# EAGLE design LowKey-BASIC-TOP (EAGLE 9.6.2)
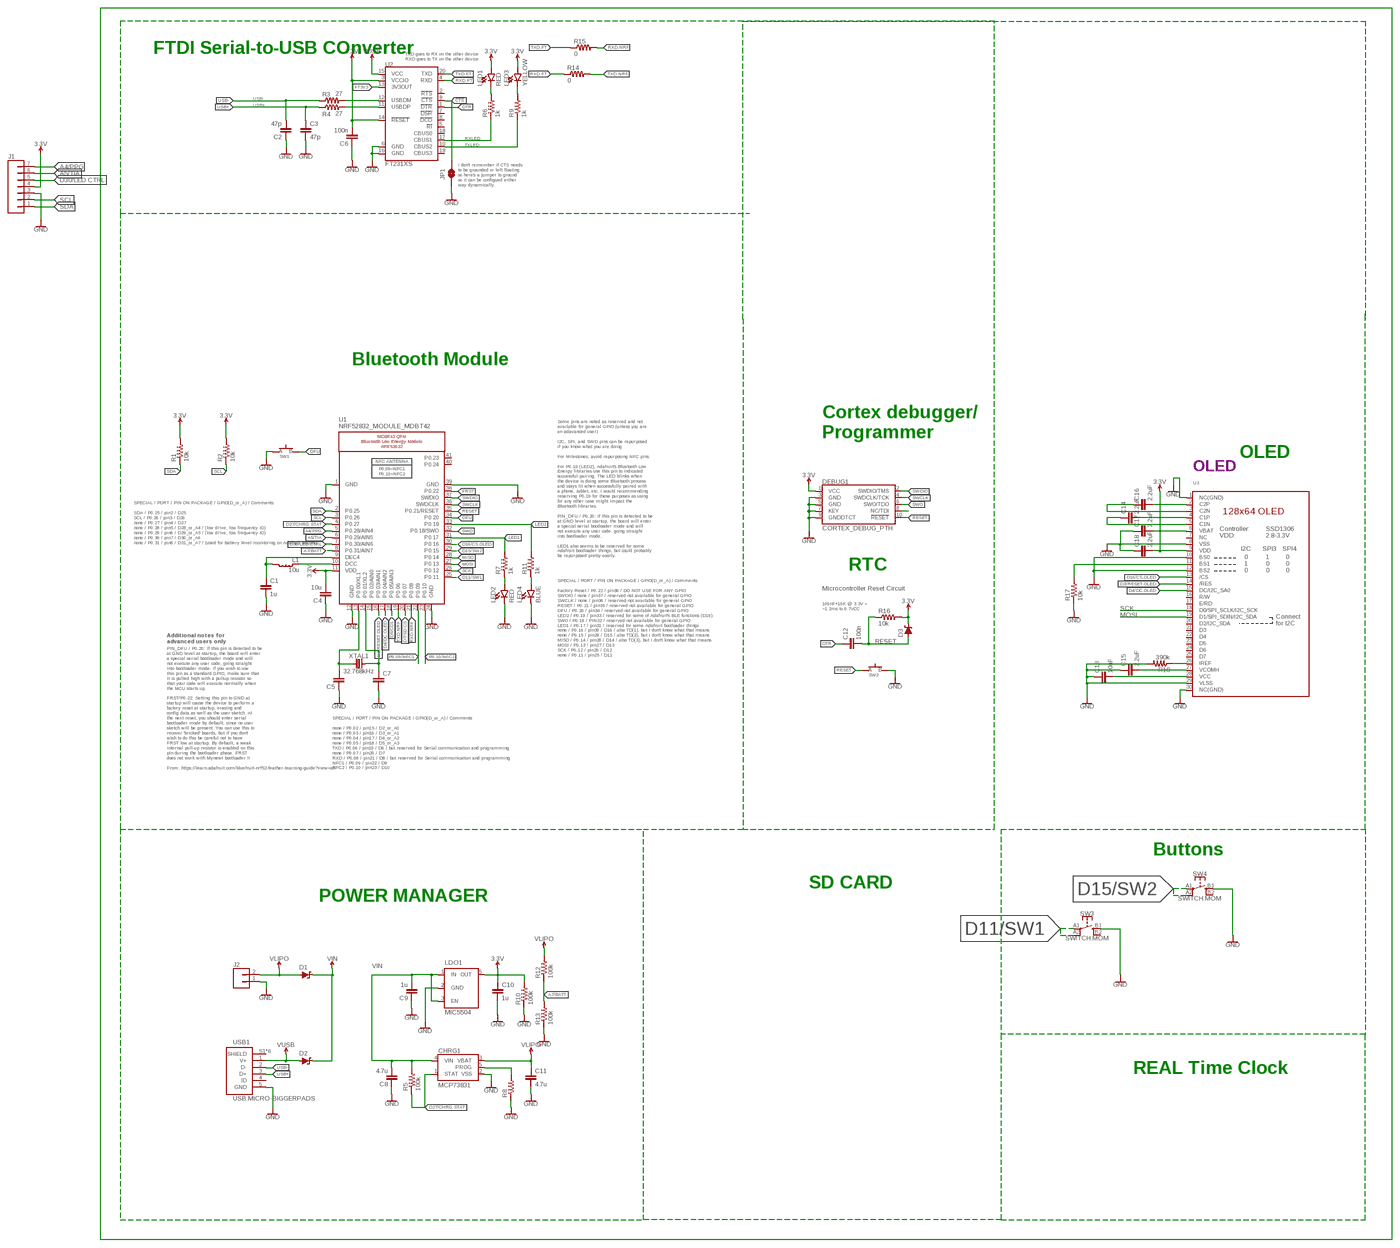
[diagram p0: schematic, sheet 1, overview]
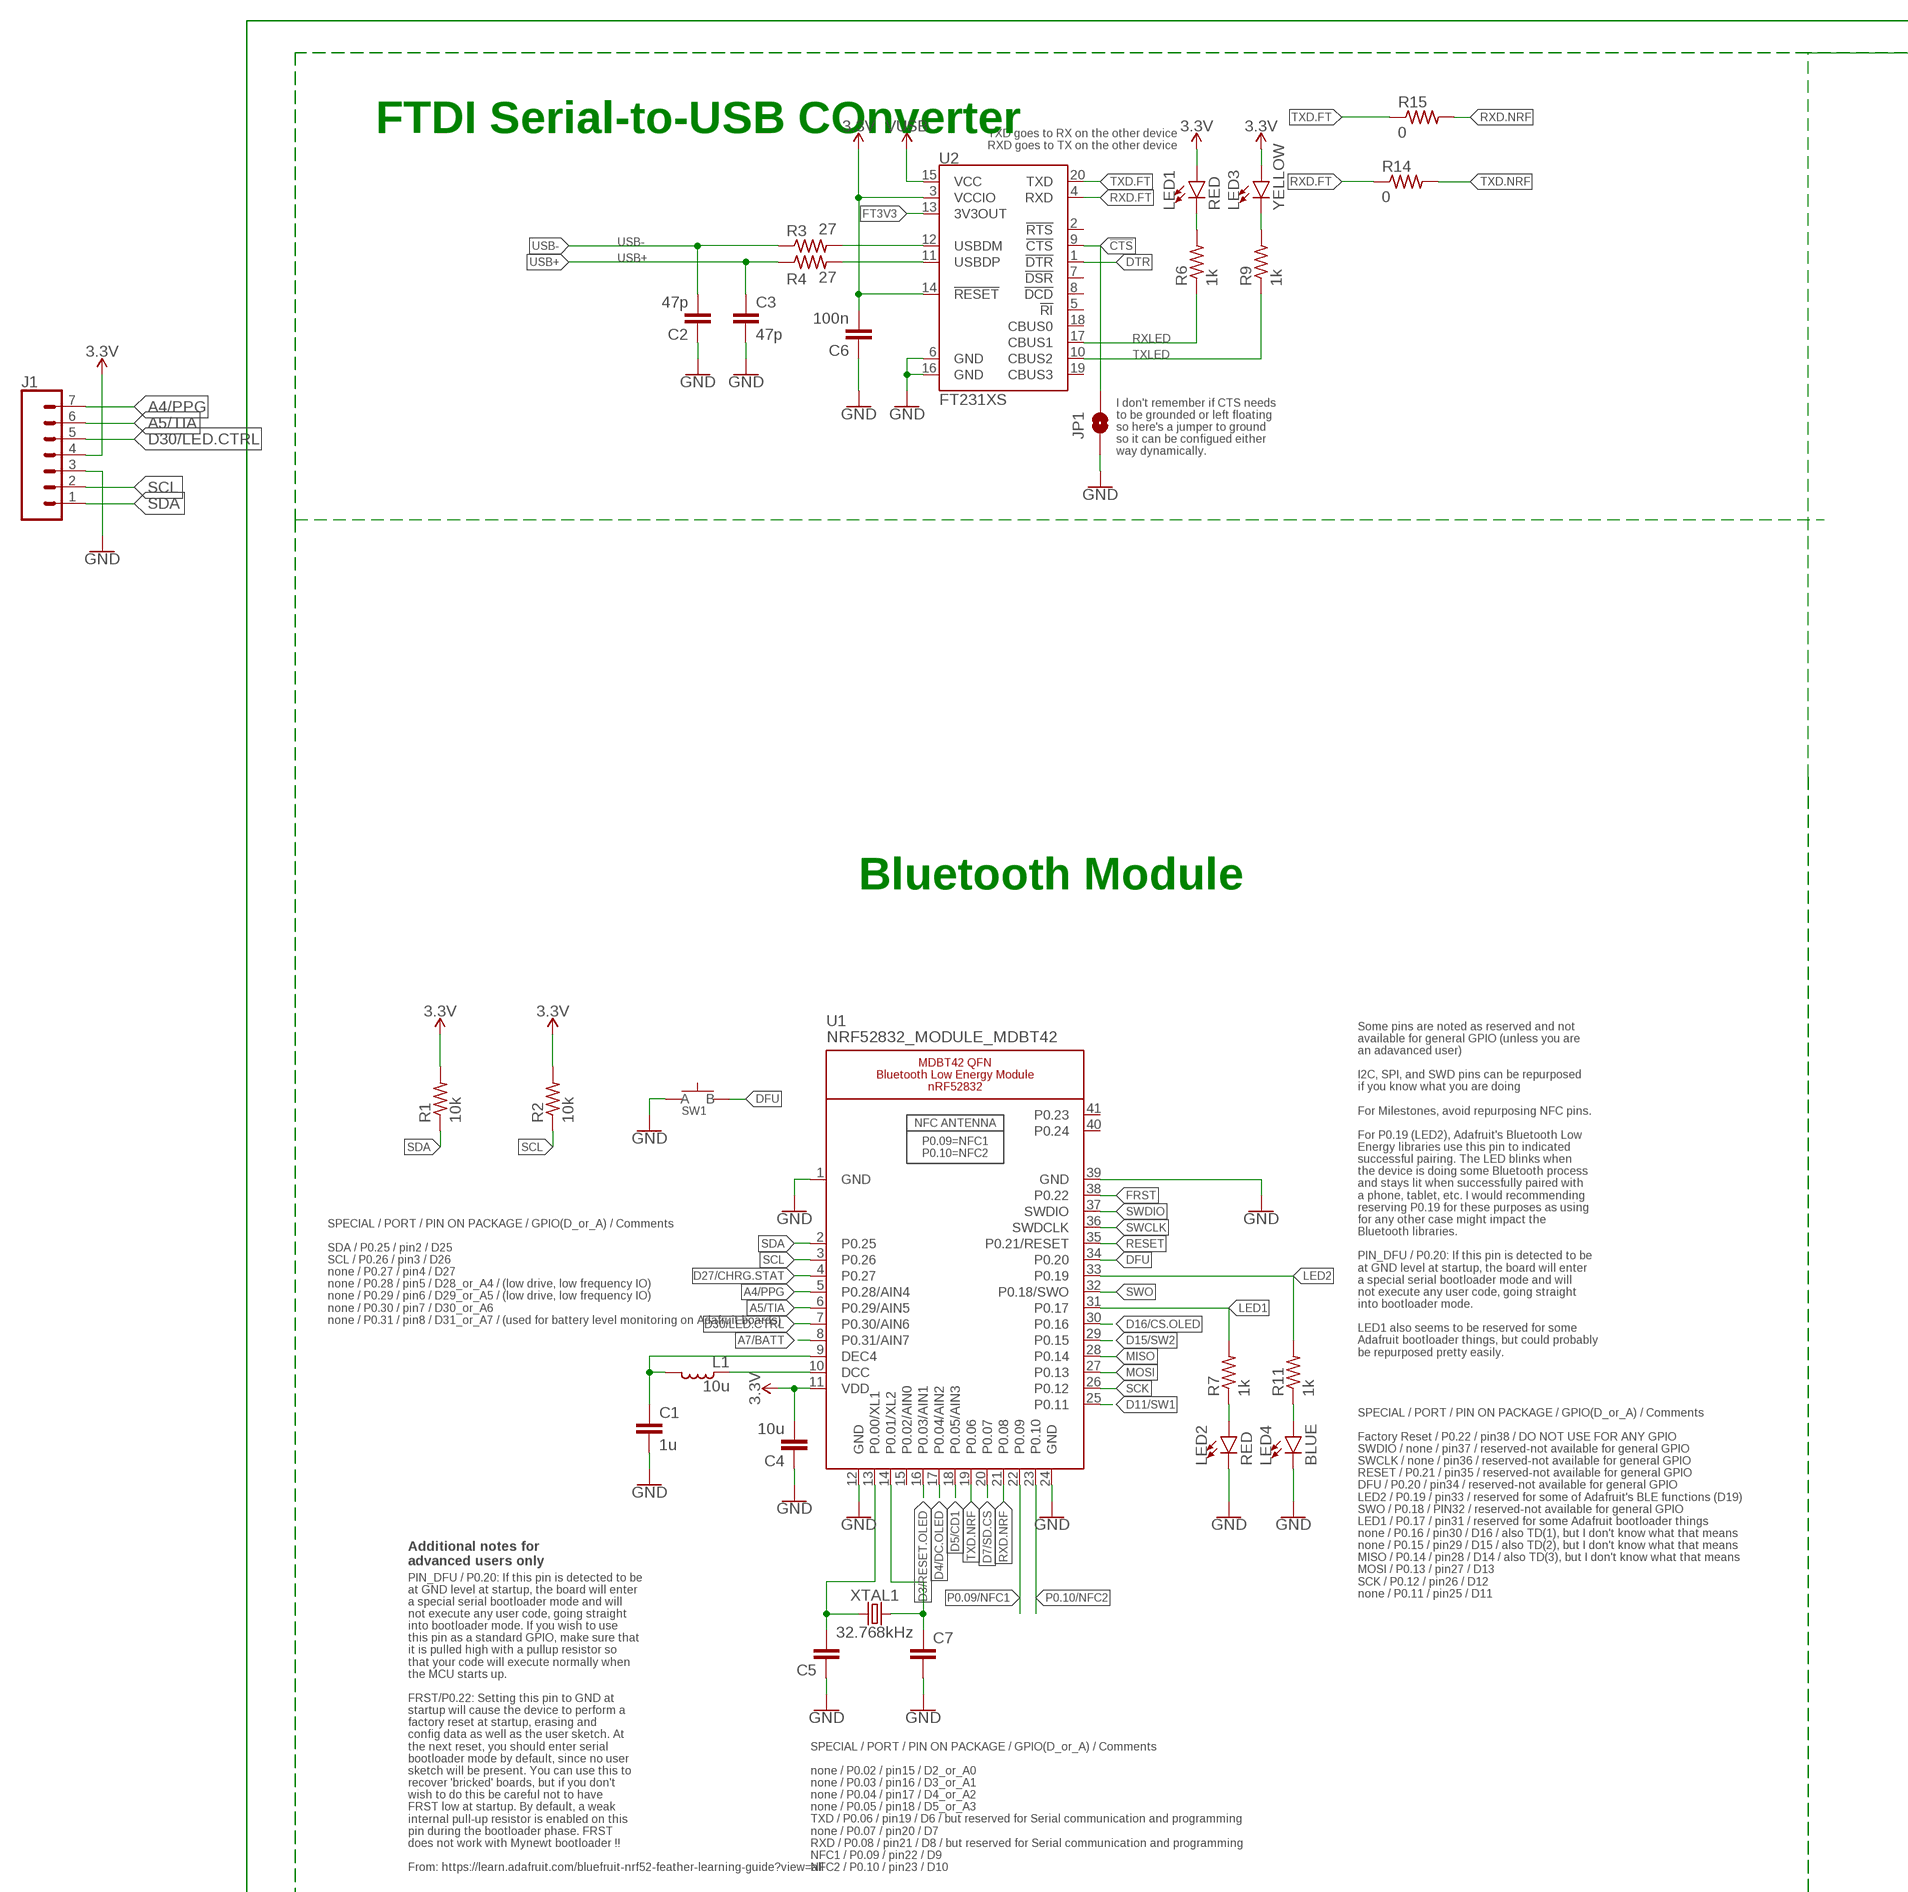
[diagram p1: schematic, sheet 1, part 1 of 4]
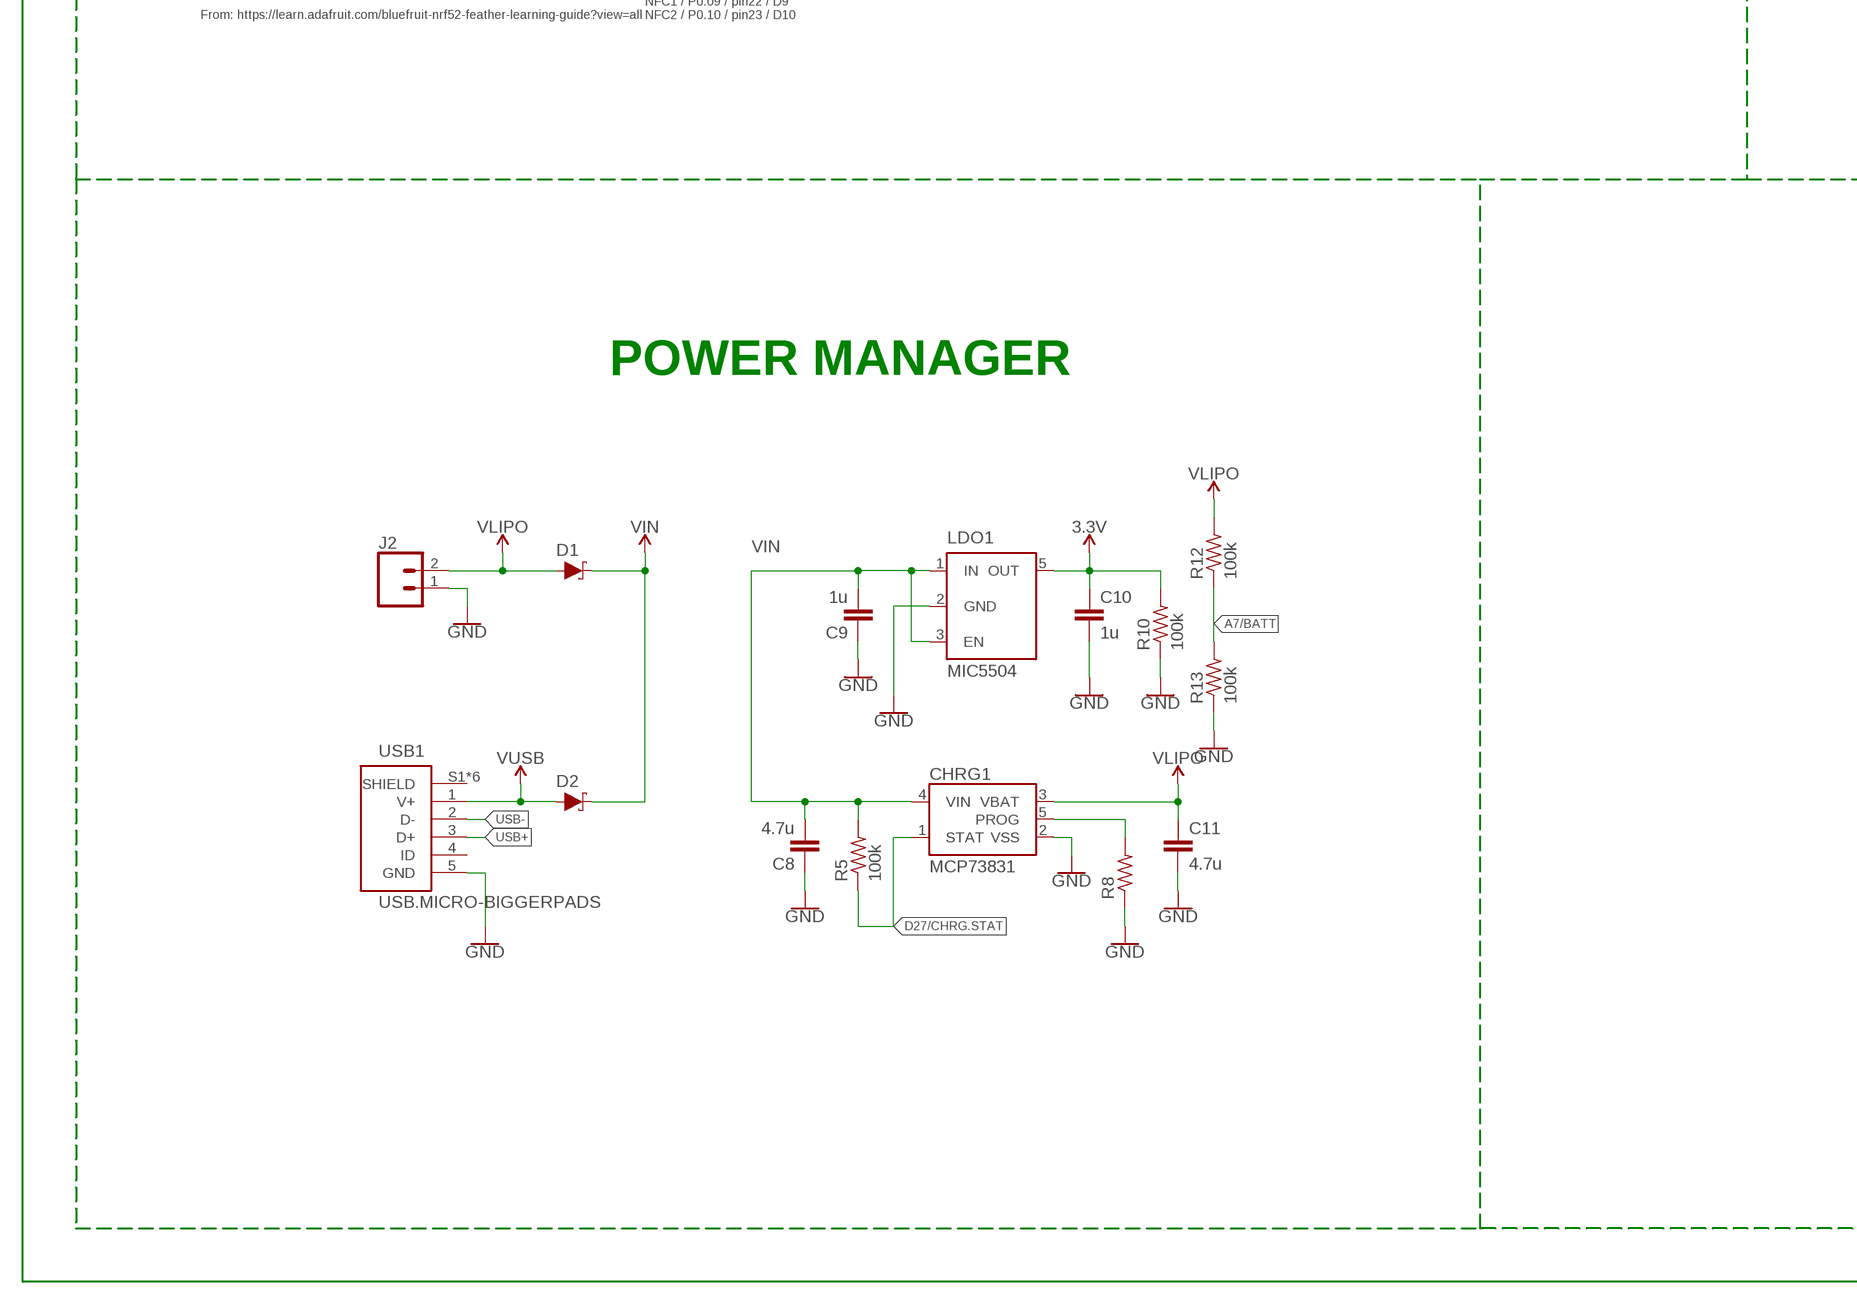
[diagram p2: schematic, sheet 1, part 2 of 4]
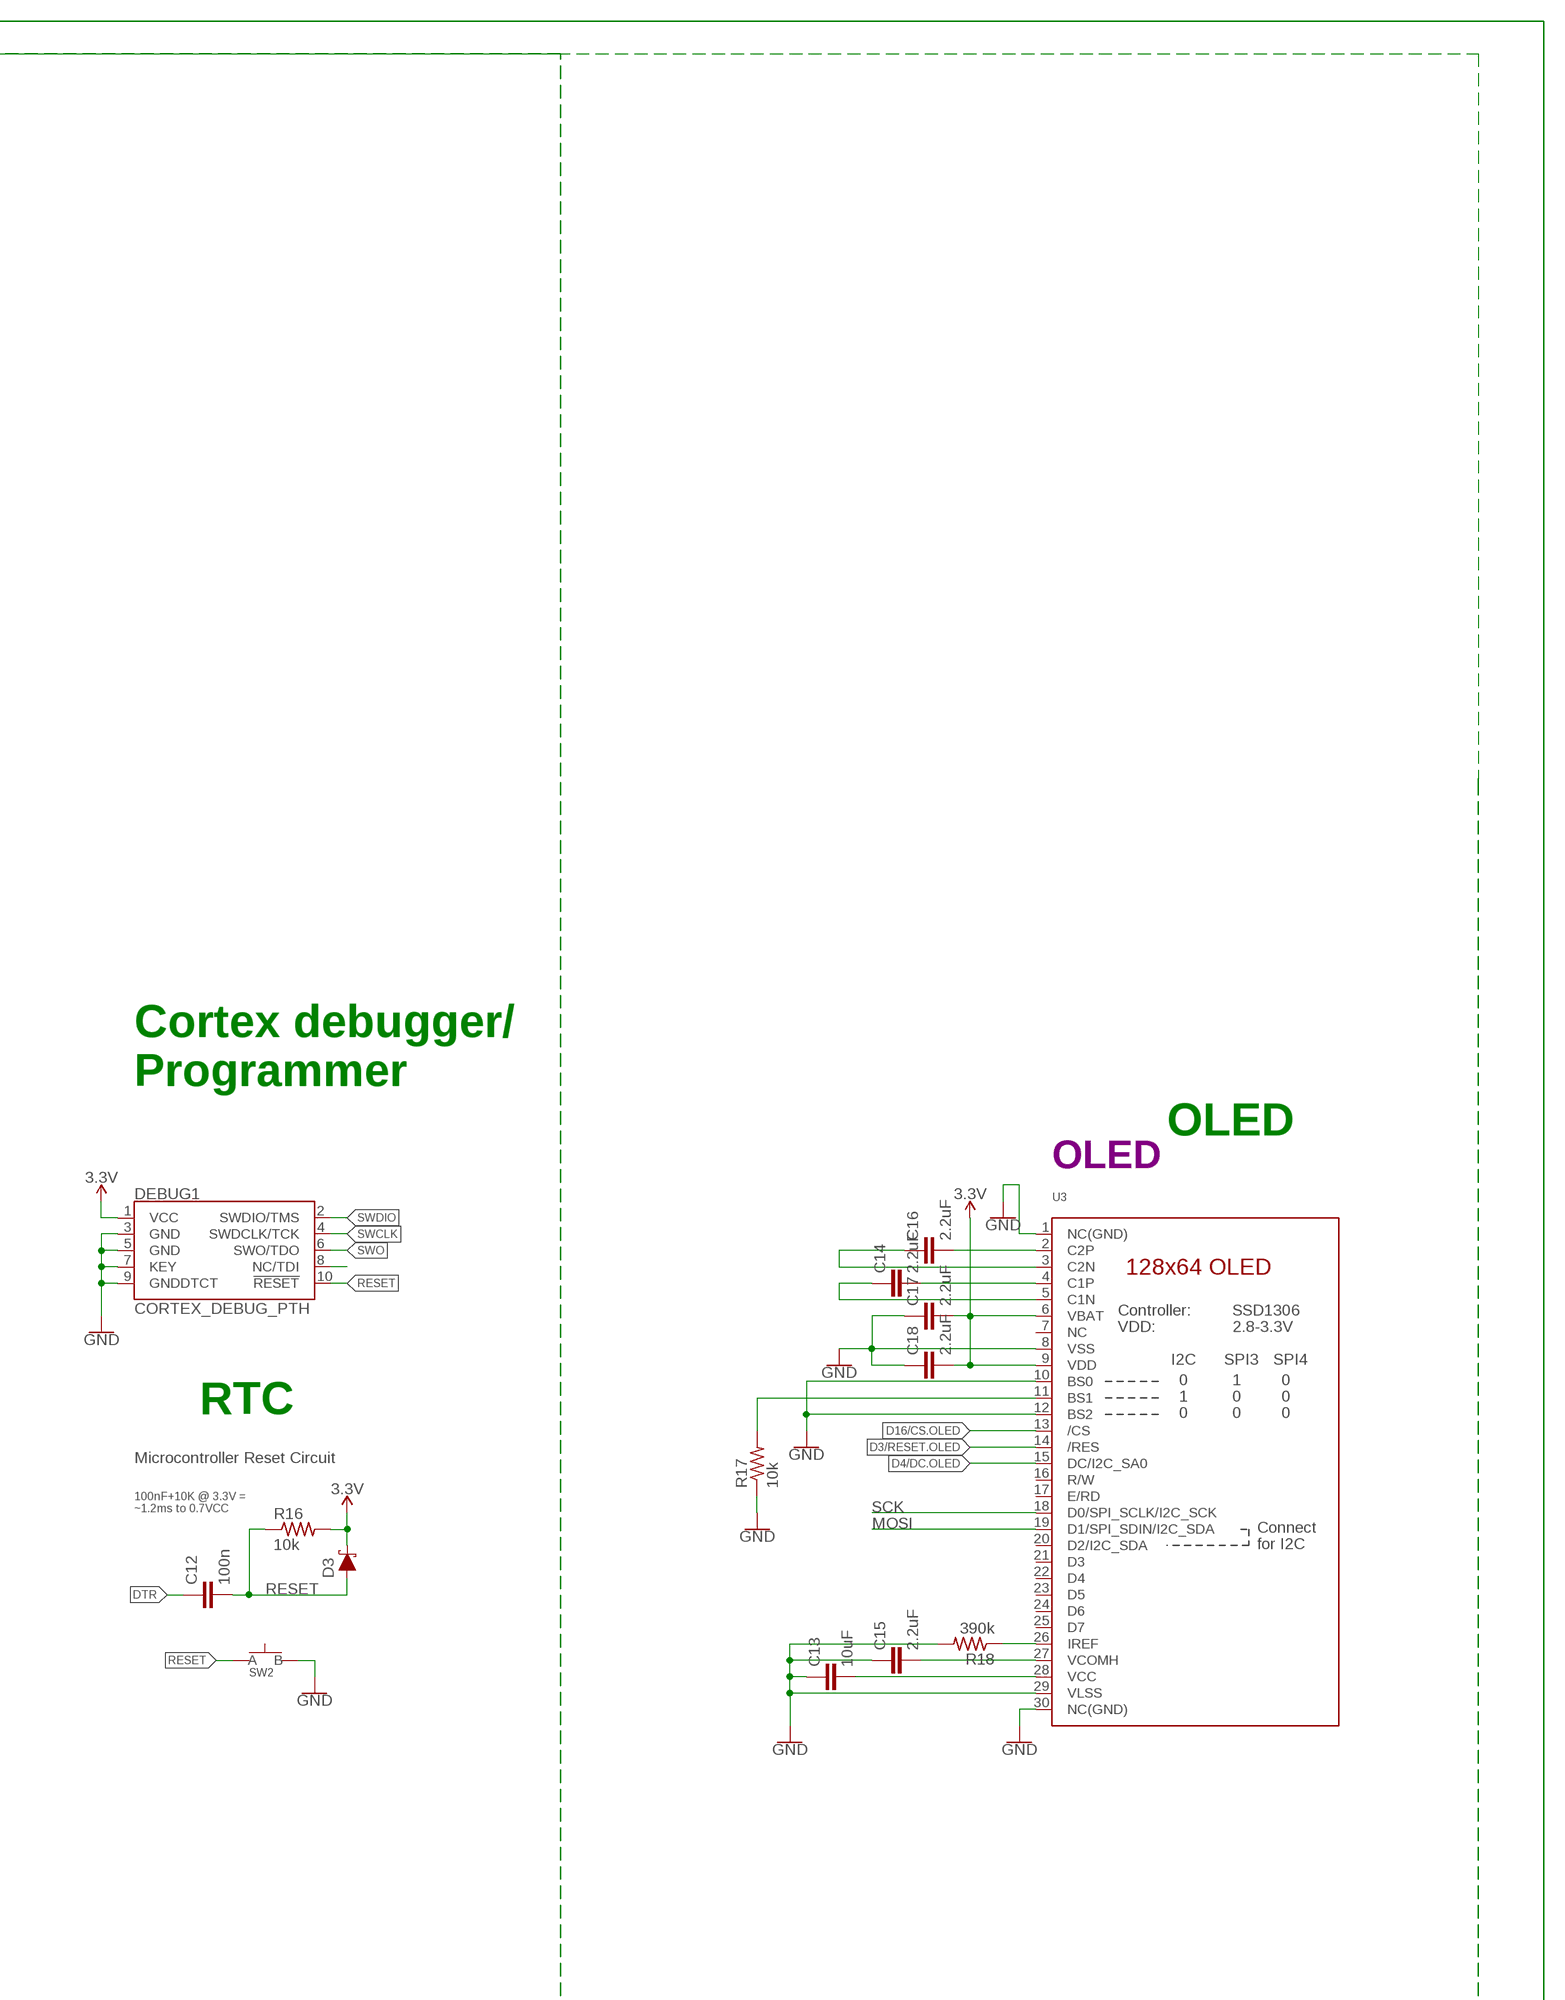
[diagram p3: schematic, sheet 1, part 3 of 4]
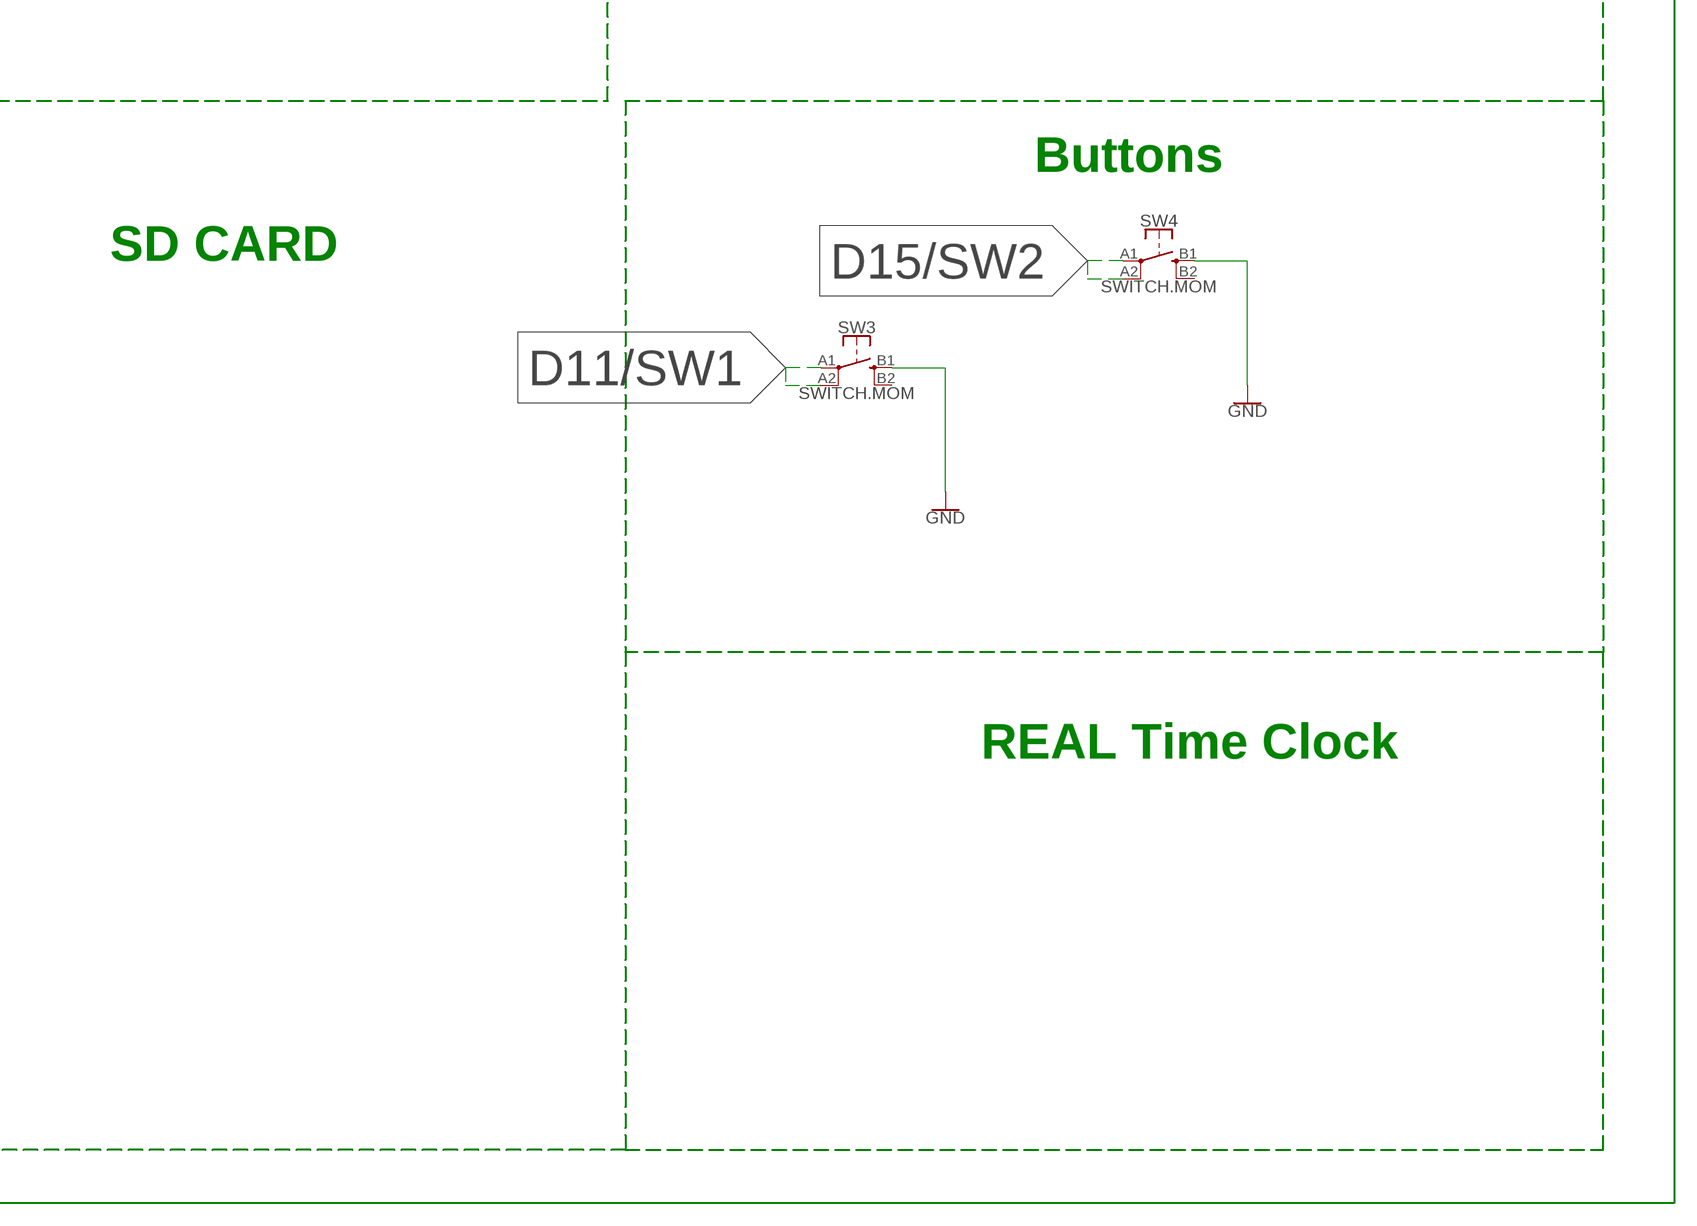
[diagram p4: schematic, sheet 1, part 4 of 4]

## Parts
C1  1u  CAPACITOR0603  [C0603]
C2  47p  CAPACITOR0603  [C0603]
C3  47p  CAPACITOR0603  [C0603]
C4  10u  CAPACITOR0805  [C0805]
C5  CAPACITOR0603  [C0603]
C6  100n  CAPACITOR0603  [C0603]
C7  CAPACITOR0603  [C0603]
C8  4.7u  CAPACITOR0603  [C0603]
C9  1u  CAPACITOR0603  [C0603]
C10  1u  CAPACITOR0603  [C0603]
C11  4.7u  CAPACITOR0603  [C0603]
C12  100n  CAPACITOR0603  [C0603]
C13  10uF  CAPACITOR0603  [C0603]
C14  2.2uF  CAPACITOR0402  [C0402]
C15  2.2uF  CAPACITOR0603  [C0603]
C16  2.2uF  CAPACITOR0402  [C0402]
C17  2.2uF  CAPACITOR0402  [C0402]
C18  2.2uF  CAPACITOR0402  [C0402]
CHRG1  MCP73831  [SOT23-5]
D1  SCHOTTKY-USC  [USC]
D2  SCHOTTKY-USC  [USC]
D3  SCHOTTKY-USC  [USC]
DEBUG1  CORTEX_DEBUG_PTH  [2X5-PTH-1.27MM]
J1  CONN_07-1.27MM  [1X07_1.27MM]
J2  CONN_02  [1X02]
JP1  JUMPER-SMT_2_NO_SILK  [SMT-JUMPER_2_NO_SILK]
L1  10u  INDUCTOR0603  [L0603]
LDO1  MIC5504  [SOT23-5]
LED1  RED  LED0603  [LED-0603]
LED2  RED  LED0603  [LED-0603]
LED3  YELLOW  LED0603  [LED-0603]
LED4  BLUE  LED0603  [LED-0603]
R1  10k  RESISTOR0603  [R0603]
R2  10k  RESISTOR0603  [R0603]
R3  27  RESISTOR0603  [R0603]
R4  27  RESISTOR0603  [R0603]
R5  100k  RESISTOR0603  [R0603]
R6  1k  RESISTOR0603  [R0603]
R7  1k  RESISTOR0603  [R0603]
R8  RESISTOR0603  [R0603]
R9  1k  RESISTOR0603  [R0603]
R10  100k  RESISTOR0603  [R0603]
R11  1k  RESISTOR0603  [R0603]
R12  100k  RESISTOR0603  [R0603]
R13  100k  RESISTOR0603  [R0603]
R14  0  RESISTOR0603  [R0603]
R15  0  RESISTOR0603  [R0603]
R16  10k  RESISTOR0603  [R0603]
R17  10k  RESISTOR0603  [R0603]
R18  390k  RESISTOR0603  [R0603]
SW1  SPST-PTS830GG140-COPY.1-3  [BUTTON-GULLWING]
SW2  SPST-PTS830GG140-COPY.1-3  [BUTTON-GULLWING]
SW3  SWITCH.MOM  [TACTILE_SWITCH_SMD_6.2MM_TALL]
SW4  SWITCH.MOM  [TACTILE_SWITCH_SMD_6.2MM_TALL]
U1  NRF52832_MODULE_MDBT42  [BLE_MODULE_RAYTAC_MDBT42]
U2  FT231XS  [SSOP20_L]
U3  DISP_OLED_UG-2864HSWEG01-NO-WRAPAROUND  [UG-2864HSWEG01_0.96IN_NO-WRAPAROUND]
USB1  USB.MICRO-BIGGERPADS  [USB-MICRO-01.BIGGERPADS]
XTAL1  32.768kHz  CRYSTALECS-.327-12.5-12-C-TR  [2-SMD.NOLEAD.2.0MMTO1.2MM]

## Nets
3.3V: C4.2 C6.2 C10.1 C17.2 C18.2 D3.-(C) DEBUG1.1(VCC) J1.4 LDO1.5(OUT) LED1.A LED3.A R1.2 R2.2 R10.2 R16.2 U1.11(VDD) U2.3(VCCIO) U2.14(!RESET) U3.6(VBAT) U3.9(VDD)
!CTS: JP1.2 U2.9(!CTS)
A4/PPG: J1.7 U1.5(P0.28/AIN4)
A5/TIA: J1.6 U1.6(P0.29/AIN5)
A7/BATT: R12.1 R13.2 U1.8(P0.31/AIN7)
D3/RESET.OLED: U1.16(P0.03/AIN1) U3.14(/RES)
D4/DC.OLED: U1.17(P0.04/AIN2) U3.15(DC/I2C_SA0)
D5/CD1: U1.18(P0.05/AIN3)
D7/SD.CS: U1.20(P0.07)
D11/SW1: SW3.A1 SW3.A2 U1.25(P0.11)
D15/SW2: SW4.A1 SW4.A2 U1.29(P0.15)
D16/CS.OLED: U1.30(P0.16) U3.13(/CS)
D27/CHRG.STAT: CHRG1.1(STAT) R5.1 U1.4(P0.27)
D30/LED.CTRL: J1.5 U1.7(P0.30/AIN6)
DFU: SW1.3(B) U1.34(P0.20)
DTR: C12.1 U2.1(!DTR)
FRST: U1.38(P0.22)
FT3V3: U2.13(3V3OUT)
GND: C1.2 C2.1 C3.2 C4.1 C5.1 C6.1 C7.2 C8.1 C9.1 C10.2 C11.2 C13.1 C15.1 C17.1 C18.1 CHRG1.2(VSS) DEBUG1.3(GND) DEBUG1.5(GND) DEBUG1.7(KEY) DEBUG1.9(GNDDTCT) J1.3 J2.1 JP1.1 LDO1.2(GND) LED2.C LED4.C R8.1 R10.1 R13.1 R17.1 R18.2 SW1.1(A) SW2.3(B) SW3.B1 SW4.B1 U1.1(GND) U1.12(GND) U1.24(GND) U1.39(GND) U2.6(GND) U2.16(GND) U3.1(NC(GND)) U3.8(VSS) U3.10(BS0) U3.12(BS2) U3.29(VLSS) U3.30(NC(GND)) USB1.5(GND)
LED1: R7.2 U1.31(P0.17)
LED2: R11.2 U1.33(P0.19)
MISO: U1.28(P0.14)
MOSI: U1.27(P0.13) U3.19(D1/SPI_SDIN/I2C_SDA)
N$1: R17.2 U3.11(BS1)
N$2: R18.1 U3.26(IREF)
N$3: C16.2 U3.2(C2P)
N$4: C5.2 U1.13(P0.00/XL1) XTAL1.P$1
N$5: C16.1 U3.3(C2N)
N$6: C7.1 U1.14(P0.01/XL2) XTAL1.P$2
N$7: C14.2 U3.4(C1P)
N$8: C14.1 U3.5(C1N)
N$9: LED2.A R7.1
N$10: LED4.A R11.1
N$11: L1.1 U1.10(DCC)
N$12: C1.1 L1.2 U1.9(DEC4)
N$13: C13.2 U3.28(VCC)
N$14: DEBUG1.8(NC/TDI)
N$15: C15.2 U3.27(VCOMH)
N$17: CHRG1.5(PROG) R8.2
N$29: R3.2 U2.12(USBDM)
N$30: R4.2 U2.11(USBDP)
N$31: LED1.C R6.2
N$32: LED3.C R9.2
P0.09/NFC1: U1.22(P0.09)
P0.10/NFC2: U1.23(P0.10)
RESET: C12.2 D3.+(A) DEBUG1.10(!RESET) R16.1 SW2.1(A) U1.35(P0.21/RESET)
RXD.FT: R14.1 U2.4(RXD)
RXD.NRF: R15.2 U1.21(P0.08)
RXLED: R6.1 U2.17(CBUS1)
SCK: U1.26(P0.12) U3.18(D0/SPI_SCLK/I2C_SCK)
SCL: J1.2 R2.1 U1.3(P0.26)
SDA: J1.1 R1.1 U1.2(P0.25)
SWCLK: DEBUG1.4(SWDCLK/TCK) U1.36(SWDCLK)
SWDIO: DEBUG1.2(SWDIO/TMS) U1.37(SWDIO)
SWO: DEBUG1.6(SWO/TDO) U1.32(P0.18/SWO)
TXD.FT: R15.1 U2.20(TXD)
TXD.NRF: R14.2 U1.19(P0.06)
TXLED: R9.1 U2.10(CBUS2)
USB+: C3.1 R4.1 USB1.3(D+)
USB-: C2.2 R3.1 USB1.2(D-)
V_USB: D2.+(A) U2.15(VCC) USB1.1(V+) ; supply symbol labelled VUSB
VIN: C8.2 C9.2 CHRG1.4(VIN) D1.-(C) D2.-(C) LDO1.1(IN) LDO1.3(EN) R5.2
VLIPO: C11.1 CHRG1.3(VBAT) D1.+(A) J2.2 R12.2
Unconnected: SW3.B2 SW4.B2 U1.15(P0.02/AIN0) U1.40(P0.24) U1.41(P0.23) U2.2(!RTS) U2.5(!RI) U2.7(!DSR) U2.8(!DCD) U2.18(CBUS0) U2.19(CBUS3) U3.7(NC) U3.16(R/W) U3.17(E/RD) U3.20(D2/I2C_SDA) U3.21(D3) U3.22(D4) U3.23(D5) U3.24(D6) U3.25(D7) USB1.4(ID) USB1.S1(SHIELD) USB1.S2(SHIELD) USB1.S3(SHIELD) USB1.S4(SHIELD) USB1.S5(SHIELD) USB1.S6(SHIELD)

## Notes on the sheet
- FTDI Serial-to-USB COnverter
- TXD goes to RX on the other device
  RXD goes to TX on the other device
- I don't remember if CTS needs
  to be grounded or left floating
  so here's a jumper to ground
  so it can be configued either
  way dynamically.
- Bluetooth Module
- Cortex debugger/
  Programmer
- OLED
- OLED
- SPECIAL / PORT / PIN ON PACKAGE / GPIO(D_or_A) / Comments
  
  SDA / P0.25 / pin2 / D25
  SCL / P0.26 / pin3 / D26
  none / P0.27 / pin4 / D27
  none / P0.28 / pin5 / D28_or_A4 / (low drive, low frequency IO)
  none / P0.29 / pin6 / D29_or_A5 / (low drive, low frequency IO)
  none / P0.30 / pin7 / D30_or_A6
  none / P0.31 / pin8 / D31_or_A7 / (used for battery level monitoring on Adafruit boards)
- Some pins are noted as reserved and not
  available for general GPIO (unless you are
  an adavanced user)
  
  I2C, SPI, and SWD pins can be repurposed
  if you know what you are doing
  
  For Milestones, avoid repurposing NFC pins.
  
  For P0.19 (LED2), Adafruit's Bluetooth Low
  Energy libraries use this pin to indicated
  successful pairing. The LED blinks when
  the device is doing some Bluetooth process
  and stays lit when successfully paired with
  a phone, tablet, etc. I would recommending
  reserving P0.19 for these purposes as using
  for any other case might impact the
  Bluetooth libraries.
  
  PIN_DFU / P0.20: If this pin is detected to be
  at GND level at startup, the board will enter
  a special serial bootloader mode and will
  not execute any user code, going straight
  into bootloader mode.
  
  LED1 also seems to be reserved for some
  Adafruit bootloader things, but could probably
  be repurposed pretty easily.
- RTC
- Microcontroller Reset Circuit
- 100nF+10K @ 3.3V =
  ~1.2ms to 0.7VCC
- Additional notes for
  advanced users only
- SPECIAL / PORT / PIN ON PACKAGE / GPIO(D_or_A) / Comments
  
  Factory Reset / P0.22 / pin38 / DO NOT USE FOR ANY GPIO
  SWDIO / none / pin37 / reserved-not available for general GPIO
  SWCLK / none / pin36 / reserved-not available for general GPIO
  RESET / P0.21 / pin35 / reserved-not available for general GPIO
  DFU / P0.20 / pin34 / reserved-not available for general GPIO
  LED2 / P0.19 / pin33 / reserved for some of Adafruit's BLE functions (D19)
  SWO / P0.18 / PIN32 / reserved-not available for general GPIO
  LED1 / P0.17 / pin31 / reserved for some Adafruit bootloader things
  none / P0.16 / pin30 / D16 / also TD(1), but I don't know what that means
  none / P0.15 / pin29 / D15 / also TD(2), but I don't know what that means
  MISO / P0.14 / pin28 / D14 / also TD(3), but I don't know what that means
  MOSI / P0.13 / pin27 / D13
  SCK / P0.12 / pin26 / D12
  none / P0.11 / pin25 / D11
- PIN_DFU / P0.20: If this pin is detected to be
  at GND level at startup, the board will enter
  a special serial bootloader mode and will
  not execute any user code, going straight
  into bootloader mode. If you wish to use
  this pin as a standard GPIO, make sure that
  it is pulled high with a pullup resistor so
  that your code will execute normally when
  the MCU starts up.
  
  FRST/P0.22: Setting this pin to GND at
  startup will cause the device to perform a
  factory reset at startup, erasing and
  config data as well as the user sketch. At
  the next reset, you should enter serial
  bootloader mode by default, since no user
  sketch will be present. You can use this to
  recover 'bricked' boards, but if you don't
  wish to do this be careful not to have
  FRST low at startup. By default, a weak
  internal pull-up resistor is enabled on this
  pin during the bootloader phase. FRST
  does not work with Mynewt bootloader !!
  
  From: https://learn.adafruit.com/bluefruit-nrf52-feather-learning-guide?view=all
- SPECIAL / PORT / PIN ON PACKAGE / GPIO(D_or_A) / Comments
  
  none / P0.02 / pin15 / D2_or_A0
  none / P0.03 / pin16 / D3_or_A1
  none / P0.04 / pin17 / D4_or_A2
  none / P0.05 / pin18 / D5_or_A3
  TXD / P0.06 / pin19 / D6 / but reserved for Serial communication and programming
  none / P0.07 / pin20 / D7
  RXD / P0.08 / pin21 / D8 / but reserved for Serial communication and programming
  NFC1 / P0.09 / pin22 / D9
  NFC2 / P0.10 / pin23 / D10
- Buttons
- SD CARD
- POWER MANAGER
- REAL Time Clock

## Library data of the parts
C1-C18 = LinnesLab-Passives:CAPACITOR
CHRG1 = LinnesLab-Power:MCP73831: MCP73831T Li-Ion, Li-Pol Controller Miniature single cell, fully integrated Li-Ion, Li-polymer charge management controller Datasheet <http://ww1.microchip.com/downloads/en/DeviceDoc/20001984g.pdf> SparkFun Products: SparkFun ESP32 Thing <https://www.sparkfun.com/products/13907> SparkFun 9DoF Razor IMU M0 <https://www.sparkfun.com/products/14001>; PROD_ID: IC-09995
D1-D3 = LinnesLab-DiscreteSemi:SCHOTTKY: Schottky diode A Schottky diode is a semiconductor diode which has a low forward voltage drop and a very fast switching action. Example: Digi-Key Part Number: RB161MM-20CT-ND
DEBUG1 = LinnesLab-Connectors:CORTEX_DEBUG: Cortex Debug Connector - 10 pin Supports JTAG debug, Serial Wire debug, and Serial Wire Viewer. PTH and SMD connector options available. General Connector Information <http://infocenter.arm.com/help/topic/com.arm.doc.faqs/attached/13634/cortex_debug_connectors.pdf> Products: PTH Connector <http://www.digikey.com/product-detail/en/cnc-tech/3220-10-0100-00/1175-1627-ND/3883661> -via Digi-Key SparkFun PSoc <https://www.sparkfun.com/products/13229> SparkFun T <https://www.sparkfun.com/products/13810>
J1 = LinnesLab-Connectors:CONN_07: Multi connection point. Often used as Generic Header-pin footprint for 0.1 inch spaced/style header connections On any of the 0.1 inch spaced packages, you can populate with these: Break Away Headers - Straight <https://www.sparkfun.com/products/116> (PRT-00116) Break Away Male Headers - Right Angle <https://www.sparkfun.com/products/553> (PRT-00553) Female Headers <https://www.sparkfun.com/products/115> (PRT-00115) Break Away Headers - Machine Pin <https://www.sparkfun.com/products/117> (PRT-00117) Break Away Female Headers - Swiss Machine Pin <https://www.sparkfun.com/products/743> (PRT-00743) For SCREWTERMINALS and SPRING TERMINALS visit here: Screw Terimnals on SparkFun.com <https://www.sparkfun.com/search/results?term=Screw+Terminals> (5mm/3.5mm/2.54mm spacing) This device is also useful as a general connection point to wire up your design to another part of your project. Our various solder wires solder well into these plated through hole pads. Hook-Up Wire - Assortment (Stranded, 22 AWG) <https://www.sparkfun.com/products/11375> (PRT-11375) Hook-Up Wire - Assortment (Solid Core, 22 AWG) <https://www.sparkfun.com/products/11367> (PRT-11367) View the entire wire category on our website here <https://www.sparkfun.com/categories/141> Special notes: Molex polarized connector foot print use with SKU : PRT-08231 with associated crimp pins and housings. 1MM SMD Version SKU: PRT-10208 NOTES ON THE VARIANTS LOCK and LOCK_LONGPADS... This footprint was designed to help hold the alignment of a through-hole component (i.e. 6-pin header) while soldering it into place. You may notice that each hole has been shifted either up or down by 0.005 of an inch from it's more standard position (which is a perfectly straight line). This slight alteration caused the pins (the squares in the middle) to touch the edges of the holes. Because they are alternating, it causes a "brace" to hold the component in place. 0.005 has proven to be the perfect amount of "off-center" position when using our standard breakaway headers. Although looks a little odd when you look at the bare footprint, once you have a header in there, the alteration is very hard to notice. Also,if you push a header all the way into place, it is covered up entirely on the bottom side.
J2 = LinnesLab-Connectors:CONN_02: Multi connection point. Often used as Generic Header-pin footprint for 0.1 inch spaced/style header connections On any of the 0.1 inch spaced packages, you can populate with these: Break Away Headers - Straight <https://www.sparkfun.com/products/116> (PRT-00116) Break Away Male Headers - Right Angle <https://www.sparkfun.com/products/553> (PRT-00553) Female Headers <https://www.sparkfun.com/products/115> (PRT-00115) Break Away Headers - Machine Pin <https://www.sparkfun.com/products/117> (PRT-00117) Break Away Female Headers - Swiss Machine Pin <https://www.sparkfun.com/products/743> (PRT-00743) For SCREWTERMINALS and SPRING TERMINALS visit here: Screw Terimnals on SparkFun.com <https://www.sparkfun.com/search/results?term=Screw+Terminals> (5mm/3.5mm/2.54mm spacing) This device is also useful as a general connection point to wire up your design to another part of your project. Our various solder wires solder well into these plated through hole pads. Hook-Up Wire - Assortment (Stranded, 22 AWG) <https://www.sparkfun.com/products/11375> (PRT-11375) Hook-Up Wire - Assortment (Solid Core, 22 AWG) <https://www.sparkfun.com/products/11367> (PRT-11367) View the entire wire category on our website here <https://www.sparkfun.com/categories/141> Special notes: Molex polarized connector foot print use with: PRT-08233 with associated crimp pins and housings. 2.54_SCREWTERM for use with PRT-10571. 3.5mm Screw Terminal footprints for PRT-08084 5mm Screw Terminal footprints for use with PRT-08432
JP1 = LinnesLab-Switches:JUMPER-SMT_2_NO: Normally open jumper This jumper has two pads in close proximity to each other. Apply solder to close the connection. Round pads are easier to solder for beginners, but are a lot larger. SparkFun Product that uses the round pads: SparkFun EL Sequencer <https://www.sparkfun.com/products/12781>
L1 = LinnesLab-Passives:INDUCTOR
LDO1 = LinnesLab-Power:MIC5504: MIC5504 Voltage Regulator Output Voltages: 1.0V to 3.3V Input Voltages: 2.5V to 5.5V Link to Datasheet http://ww1.microchip.com/downloads/en/DeviceDoc/MIC550X.pdf
LED1-LED4 = LinnesLab-LED:LED: LED (Generic) Standard schematic elements and footprints for 5mm, 3mm, 1206, and 0603 sized LEDs. Generic LEDs with no color specified. LTST-C190KGKT: arrow indicates cathode
R1-R18 = LinnesLab-Passives:RESISTOR
SW1 SW2 = LinnesLab-Switches:SPST-PTS830GG140-COPY
SW3 SW4 = LinnesLab-Switches:SWITCH.MOM: PTS645SM43SMTR92 LFS
U1 = LinnesLab-Microcontrollers:NRF52832_MODULE_MDBT42: MDBT42 - BLE Module (nRF52832 QFN) VDD: 1.7-3.6V
U2 = LinnesLab-DigitalIC:FT231X: FTDI FT231X Full Speed USB to Full-handshake UART This USB2.0 Full Speed IC offers a compact bridge to full handshake UART interfaces. The device is a UART, capable of operating up to 3MBaud, with low power consumption (8mA). The FT231X includes the complete FT-X series feature set and enables USB to be added into a system design quickly and easily over a UART interface. Datasheet <http://cdn.sparkfun.com/datasheets/Components/General%20IC/DS_FT231X.pdf>; DIGIKEY: 768-1156-5-ND; MFN: FT231XS-U
U3 = LinnesLab-Displays:DISP_OLED_UG-2864HSWEG01: UG-2864HSWEG01 OLED display Both 1.3" and 0.96" models share the same FPC tab footprint, only the screen dimensions vary.
USB1 = LinnesLab-Connectors:USB.MICRO: DigiKey PN: 609-4613-1-ND
XTAL1 = LinnesLab-Clocks:CRYSTAL; DIGIKEY: XC2288CT-ND; FREQ: 32.7680KHZ; LOAD_CAP: 12.5pF

## Board
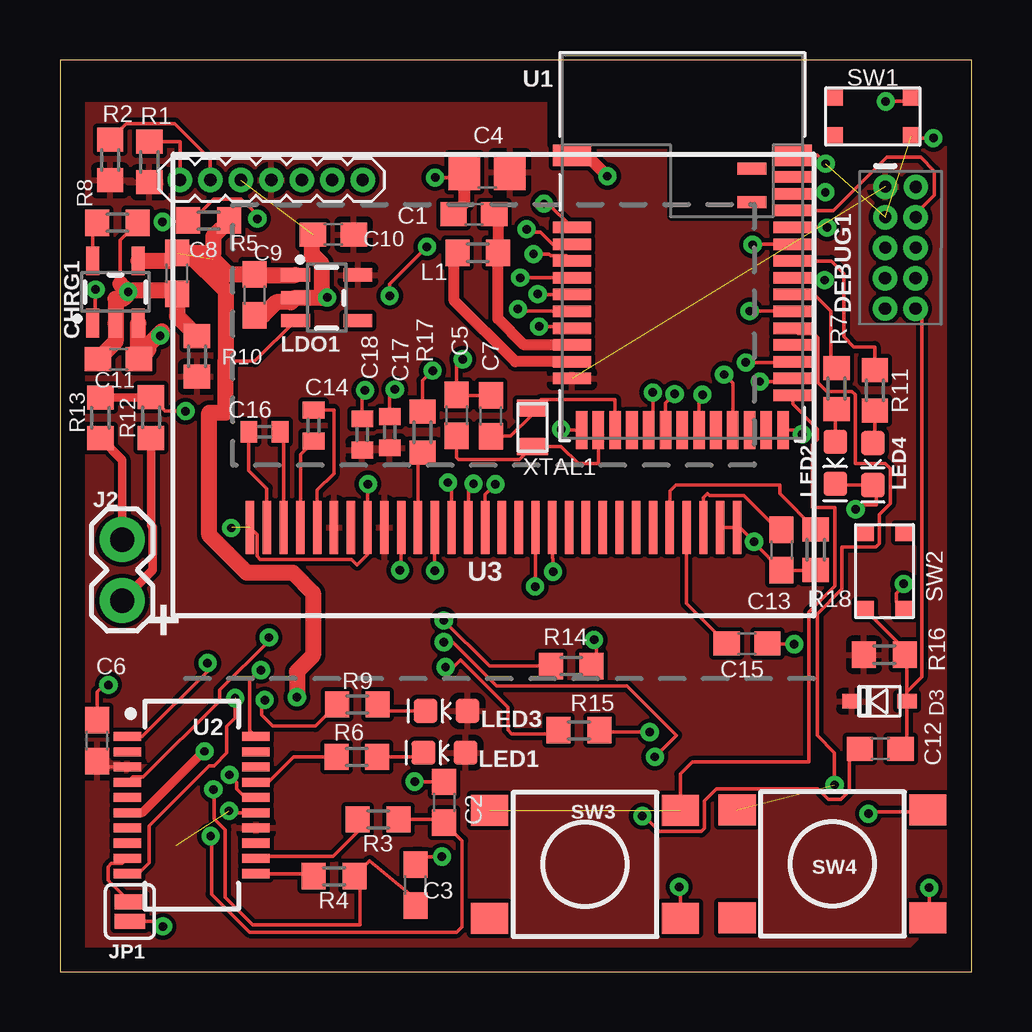
[diagram p5: board, top side]
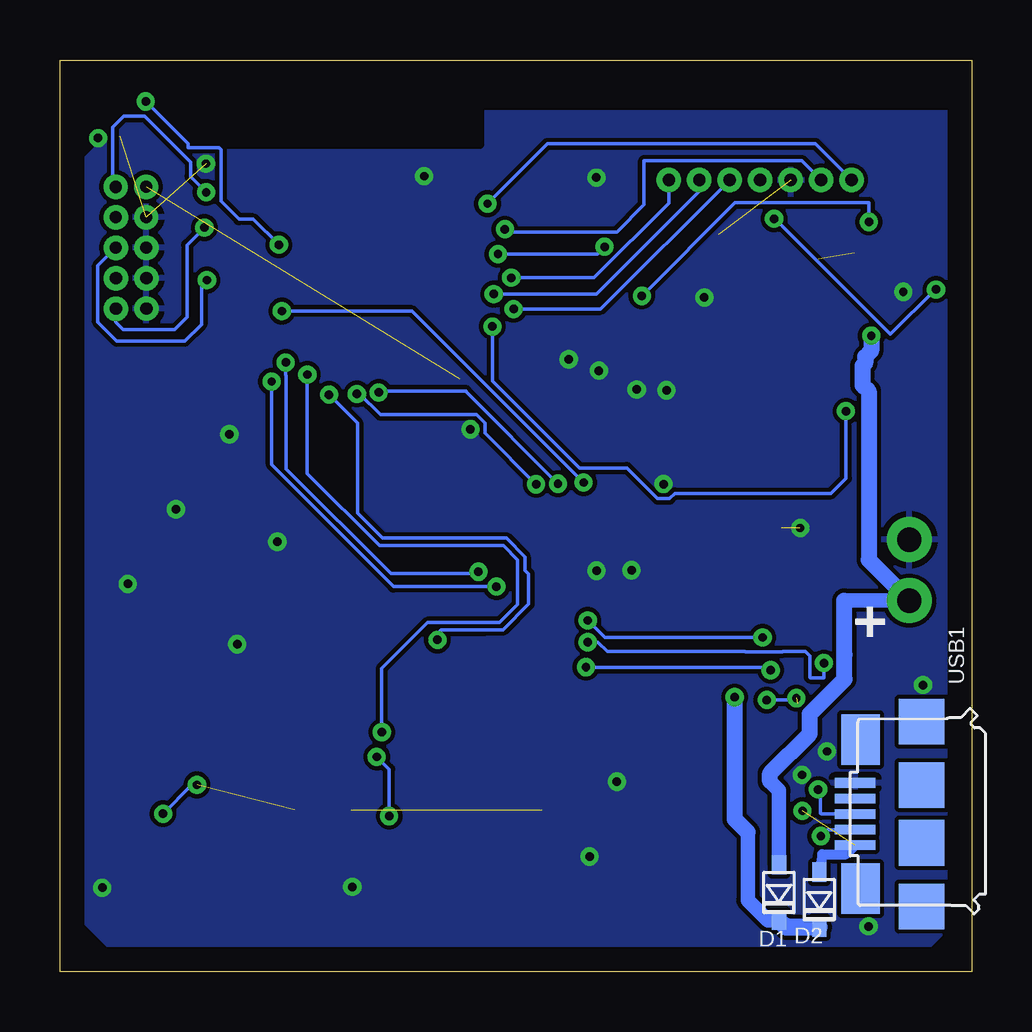
[diagram p6: board, bottom side, seen from below]

Size 38 x 38 mm. Coordinates in mm from the lower left corner, seen from the top.
Outline: 0,0 38,0 38,38 0,38 0,0
Copper layers (1*16): Top 0.035mm / dielectric 1.5mm / Bottom 0.035mm
Design rules "default": minimum track width 6mil, minimum drill 0.35mm, track to track 6mil, track to pad 6mil, pad to pad 6mil, via to via 6mil, smd to smd 6mil, copper to edge 40mil, drill to drill 6mil, minimum pad ring 10mil, minimum via ring 8mil, stop-mask expansion 4mil, vias tented up to drill 0mil, thermal gap 10mil

### Footprints (pad centres in the part's own frame; a part is rotated, then mirrored left to right if it is on the bottom)
C0603 = smd 1.1 x 1: 1 -0.85,0; 2 0.85,0
C0805 = smd 1.3 x 1.5: 1 -0.95,0; 2 0.95,0
C0402 = smd 0.7 x 0.9: 1 -0.65,0; 2 0.65,0
SOT23-5 = smd 0.55 x 1.2: 1 -0.95,-1.3; 2 0,-1.3; 3 0.95,-1.3; 4 0.95,1.3; 5 -0.95,1.3
USC = smd 0.8 x 0.6: + -1.15,0; - 1.15,0
2X5-PTH-1.27MM = drill 0.508 pad 1: 1 -2.54,-0.635; 2 -2.54,0.635; 3 -1.27,-0.635; 4 -1.27,0.635; 5 0,-0.635; 6 0,0.635; 7 1.27,-0.635; 8 1.27,0.635; 9 2.54,-0.635; 10 2.54,0.635
1X07_1.27MM = drill 0.508 pad 1: 1 0,0; 2 1.27,0; 3 2.54,0; 4 3.81,0; 5 5.08,0; 6 6.35,0; 7 7.62,0
1X02 = drill 1.016 pad 1.88: 1 0,0; 2 2.54,0
SMT-JUMPER_2_NO_SILK = smd 0.635 x 1.27: 1 -0.406,0; 2 0.406,0
L0603 = smd 1 x 1.1: 1 -0.85,0; 2 0.85,0
LED-0603 = smd 1 x 1: A -0.877,0; C 0.877,0
R0603 = smd 1 x 1.1: 1 -0.85,0; 2 0.85,0
BUTTON-GULLWING = smd 0.7 x 0.75: 1 -1.6,0.825; 2 1.6,0.825; 3 -1.6,-0.825; 4 1.6,-0.825
TACTILE_SWITCH_SMD_6.2MM_TALL = smd 1.55 x 1.3: A1 -3.975,-2.25; A2 3.975,-2.25; B1 -3.975,2.25; B2 3.975,2.25
BLE_MODULE_RAYTAC_MDBT42 = smd 1.6 x 0.9: 1 -4.6,3.8; 39 4.6,3.8 | smd 1.6 x 0.48: 2 -4.6,0.8; 3 -4.6,0.1; 4 -4.6,-0.6; 5 -4.6,-1.3; 6 -4.6,-2; 7 -4.6,-2.7; 8 -4.6,-3.4; 9 -4.6,-4.1; 10 -4.6,-4.8; 11 -4.6,-5.5; 25 4.6,-6.2; 26 4.6,-5.5; 27 4.6,-4.8; 28 4.6,-4.1; 29 4.6,-3.4; 30 4.6,-2.7; 31 4.6,-2; 32 4.6,-1.3; 33 4.6,-0.6; 34 4.6,0.1; 35 4.6,0.8; 36 4.6,1.5; 37 4.6,2.2; 38 4.6,2.9 | smd 0.48 x 1.6: 12 -4.2,-7.65; 13 -3.5,-7.65; 14 -2.8,-7.65; 15 -2.1,-7.65; 16 -1.4,-7.65; 17 -0.7,-7.65; 18 0,-7.65; 19 0.7,-7.65; 20 1.4,-7.65; 21 2.1,-7.65; 22 2.8,-7.65; 23 3.5,-7.65; 24 4.2,-7.65 | smd 1.2 x 0.5: 40 2.9,3.25; 41 2.9,1.85
SSOP20_L = smd 0.381 x 1.143: 1 -2.857,-2.68; 2 -2.223,-2.68; 3 -1.587,-2.68; 4 -0.953,-2.68; 5 -0.318,-2.68; 6 0.318,-2.68; 7 0.953,-2.68; 8 1.587,-2.68; 9 2.223,-2.68; 10 2.857,-2.68; 11 2.857,2.68; 12 2.223,2.68; 13 1.587,2.68; 14 0.953,2.68; 15 0.318,2.68; 16 -0.318,2.68; 17 -0.953,2.68; 18 -1.587,2.68; 19 -2.223,2.68; 20 -2.857,2.68
UG-2864HSWEG01_0.96IN_NO-WRAPAROUND = smd 0.35 x 2.2: 1 -10.15,-1.2; 2 -9.45,-1.2; 3 -8.75,-1.2; 4 -8.05,-1.2; 5 -7.35,-1.2; 6 -6.65,-1.2; 7 -5.95,-1.2; 8 -5.25,-1.2; 9 -4.55,-1.2; 10 -3.85,-1.2; 11 -3.15,-1.2; 12 -2.45,-1.2; 13 -1.75,-1.2; 14 -1.05,-1.2; 15 -0.35,-1.2; 16 0.35,-1.2; 17 1.05,-1.2; 18 1.75,-1.2; 19 2.45,-1.2; 20 3.15,-1.2; 21 3.85,-1.2; 22 4.55,-1.2; 23 5.25,-1.2; 24 5.95,-1.2; 25 6.65,-1.2; 26 7.35,-1.2; 27 8.05,-1.2; 28 8.75,-1.2; 29 9.45,-1.2; 30 10.15,-1.2
USB-MICRO-01.BIGGERPADS = smd 0.4 x 1.7: 1 -1.3,1.505; 2 -0.65,1.505; 3 0,1.505; 4 0.65,1.505; 5 1.3,1.505 | smd 1.9 x 1.9: S1 -3.85,-1.27; S2 -1.2,-1.27; S3 1.2,-1.27; S4 3.85,-1.27 | smd 2.1 x 1.6: S5 -3.1,1.28; S6 3.1,1.28
2-SMD.NOLEAD.2.0MMTO1.2MM = smd 0.7 x 1.3: P$1 -0.8,0; P$2 0.8,0

### Placement (x,y rotation side)
C1  17.25,31.57 180 top
C2  16.01,7.06 270 top
C3  14.83,3.6 90 top
C4  17.8,33.33 0 top
C5  16.53,23.19 270 top
C6  1.54,9.62 270 top
C7  17.97,23.16 90 top
C8  4.88,29.1 90 top
C9  8.12,28.21 90 top
C10  11.4,30.73 180 top
C11  2.44,25.53 180 top
C12  34.19,9.29 0 top
C13  30.08,17.57 90 top
C14  10.57,22.76 270 top
C15  28.64,13.67 180 top
C16  8.53,22.5 180 top
C17  13.75,22.48 270 top
C18  12.6,22.39 270 top
CHRG1  2.31,28.33 0 top
D1  8.03,3.29 270 bottom
D2  6.34,2.99 270 bottom
D3  34.16,11.27 180 top
DEBUG1  35.04,30.17 269.9 top
J1  5,33 0 top
J2  2.59,18 270 top
JP1  2.91,2.5 90 top
L1  17.41,29.96 0 top
LDO1  11.12,28.09 270 top
LED1  16.03,9.12 180 top
LED2  32.32,21.21 270 top
LED3  16.11,10.87 180 top
LED4  33.88,21.15 270 top
R1  3.73,33.75 270 top
R2  2.1,33.84 270 top
R3  13.27,6.34 180 top
R4  11.42,3.98 180 top
R5  6.2,31.31 0 top
R6  12.37,8.95 0 top
R7  32.37,24.3 90 top
R8  2.4,31.22 180 top
R9  12.4,11.14 0 top
R10  5.71,25.64 270 top
R11  33.97,24.23 90 top
R12  3.8,23.1 270 top
R13  1.69,23.09 90 top
R14  21.31,12.73 0 top
R15  21.64,10.06 0 top
R16  34.37,13.21 180 top
R17  15.11,22.48 270 top
R18  31.5,17.58 270 top
SW1  33.89,35.65 180 top
SW2  34.37,16.69 90 top
SW3  21.89,4.47 180 top
SW4  32.2,4.49 180 top
U1  25.94,30.22 0 top
U2  5.49,6.94 270 top
U3  18.07,19.71 0 top
USB1  3.35,6.57 90 bottom
XTAL1  19.7,22.68 90 top

### Tracks (layer width: path | path; a pad name or v marks a point on that pad's centre or on a via)
3.3V  (1 unrouted)
  Top 0.152: U2.3 1.79,8.53 C6.2
  pour Top (isolate 0.178): 0.92,36.18 37.65,36.18 37.65,3.26 34.74,0.36 0.92,0.36
!CTS
  Top 0.152: JP1.2 2.15,3.66 2.01,3.8 2.01,4.37 2.15,4.5 2.6,4.5 U2.9
A4/PPG  (via drill 0.35)
  Top 0.152: U1.5 v19.19,28.92
  Bottom 0.152: v19.19,28.92 15.73,28.92 12.62,32.03 J1.7
A5/TIA  (via drill 0.35)
  Top 0.152: U1.6 20.53,28.22 20.54,28.21 19.95,28.21 v19.92,28.24
  Bottom 0.152: v19.92,28.24 19.56,28.24 19.55,28.23 15.64,28.23 11.35,32.52 J1.6
A7/BATT  (via drill 0.35)
  Top 0.152: v19.98,26.89 20.61,26.89 20.68,26.82 U1.8 | v5.23,23.36 4.39,23.36 R12.1
  Top 0.356: R12.1 3.79,23.94 R13.2
  Bottom 0.152: v19.98,26.89 19.98,24.62 16.35,20.99 14.37,20.99 13.09,19.71 12.59,19.71 12.37,19.93 5.86,19.93 5.23,20.55 v5.23,23.36
D3/RESET.OLED  (via drill 0.35)
  Top 0.152: U3.14 17.02,20.11 v17.24,20.33 | v24.71,24.14 24.71,22.74 U1.16
  Bottom 0.152: v17.24,20.33 21.08,24.17 21.08,24.2 24.65,24.2 v24.71,24.14
D4/DC.OLED  (via drill 0.35)
  Top 0.152: U1.17 25.24,23.7 v25.62,24.08 | v18.15,20.31 17.72,19.88 U3.15
  Bottom 0.152: v18.15,20.31 20.29,22.44 20.29,22.86 20.64,23.21 24.64,23.21 25.51,24.08 v25.62,24.08
D11/SW1  (1 unrouted)
  Top 0.152: 25.86,7.11 SW3.A1 25.86,8.23 26.36,8.73 31.22,8.73 31.22,14.99 32.3,16.07 32.3,19.35 31.37,19.35 31.37,21.97 31.57,22.17 31.57,22.62 30.54,23.65 U1.25
D15/SW2  (via drill 0.35)  (1 unrouted)
  Top 0.152: U1.29 30.77,26.59 31.44,26.59 31.59,26.44 31.59,24.55 31.97,24.18 33.01,24.18 33.15,24.04 33.15,21.18 34.4,21.18 34.61,20.96 34.61,19.51 34.15,19.05 34.15,17.85 34.01,17.71 32.6,17.71 32.6,15.94 31.57,14.9 31.57,9.84 32.29,9.12 v32.29,7.78 | v33.7,6.58 33.78,6.66 36.1,6.66 SW4.A1
  Bottom 0.152: v32.29,7.78 32.5,7.78 v33.7,6.58
D16/CS.OLED  (via drill 0.35)
  Top 0.152: U3.13 16.32,20.23 v16.17,20.38 | v28.75,27.53 U1.30
  Bottom 0.152: v16.17,20.38 23.32,27.53 v28.75,27.53
D27/CHRG.STAT  (via drill 0.35)
  Top 0.152: R5.1 5.28,31.31 | v8.23,31.38 8.23,31.53 7.56,32.2 6.4,32.2 5.51,31.31 5.29,31.31 5.28,31.31 | v1.48,28.43 1.48,27.14 CHRG1.1 | U1.4 21.11,29.85 20.45,29.85 20.39,29.91 v19.74,29.91 | v15.3,30.21 13.75,28.66 v13.75,28.16 | v4.28,31.25 5.23,31.25 5.28,31.31
  Bottom 0.152: v8.23,31.38 8.19,31.38 3.38,26.57 1.52,28.43 v1.48,28.43 | v19.74,29.91 15.6,29.91 v15.3,30.21 | v13.75,28.16 9.86,32.05 4.27,32.05 v4.27,31.26 v4.28,31.25
D30/LED.CTRL  (via drill 0.35)
  Top 0.152: U1.7 19.19,27.52 v19.09,27.62
  Bottom 0.152: v19.09,27.62 15.46,27.62 J1.5
DFU  (via drill 0.35)
  Top 0.152: U1.34 28.9,30.32 v28.88,30.3 | v34.42,36.27 35.29,36.27 SW1.3
  Bottom 0.152: v28.88,30.3 29.94,31.36 30.53,31.36 31.29,32.12 31.29,34.27 31.37,34.35 32.66,34.35 32.66,34.51 v34.42,36.27
DTR  (via drill 0.35)
  Top 0.152: C12.1 32.9,8.84 32.9,7.53 32.54,7.17 32.04,7.17 31.6,7.61 27.36,7.61 26.87,7.12 26.87,5.97 26.73,5.84 24.99,5.84 24.35,6.48 v24.28,6.48 | U2.1 3.44,9.8 6.15,12.51 v6.15,12.86 | v24.8,8.95 25.7,9.85 23.63,11.91 18.19,11.91 16.38,13.73 v16,13.73
  Bottom 0.152: v6.15,12.86 6.15,12.24 6.72,12.24 6.75,12.27 6.75,13.16 6.93,13.34 7.87,13.34 7.89,13.32 9.42,13.32 9.44,13.34 15.18,13.34 15.56,13.73 v16,13.73 | v24.28,6.48 24.28,8.43 v24.8,8.95
GND  (via drill 0.35)  (4 unrouted)
  Top 0.152: 7.16,18.51 v7.14,18.49 | U3.1 8.22,18.22 8.22,17.32 8.35,17.18 12.16,17.18 12.39,16.96 12.82,17.39 U3.8 12.82,20.3 v12.84,20.32 | C18.1 12.6,24.11 v12.71,24.23 | v13.96,24.27 13.75,24.06 C17.1 | v15.54,25.05 15.11,24.63 R17.1 15.3,23.15 | U3.10 14.22,16.78 v14.17,16.73 | U3.12 v15.62,16.72 v15.63,16.71 | U3.29 U3.30 28.34,18.51 v28.94,17.92 28.96,17.9 28.96,17.84 C13.1 31.49,16.72 R18.2 | C2.1 14.8,7.91 v14.79,7.92 | C3.2 14.72,4.36 | 14.72,4.36 14.72,4.33 | v15.92,4.79 15.22,4.79 15.07,4.94 14.72,4.94 14.72,4.36 | C7.2 16.55,24.02 C5.1 16.53,25.26 v16.79,25.52 | U1.12 20.92,22.57 v20.89,22.6 | v35.17,16.16 35.17,16.07 34.87,15.77 34.87,15.41 SW2.3 | LED2.C 32.38,20.28 LED4.C 34.04,20.12 34.04,19.44 33.34,19.44 v33.17,19.27 | v30.94,22.39 30.76,22.57 U1.24 | U1.39 31.57,34.02 v31.91,33.67 | SW1.1 35.56,34.74 v36.41,34.74 | v30.61,13.65 v30.6,13.66 29.5,13.66 C15.1 | SW3.B1 25.86,3.48 v25.81,3.53 | SW4.B1 36.24,2.29 v36.24,3.5 | C4.1 16.62,33.1 v15.64,33.1 | C6.1 1.54,11.66 1.82,11.95 v2.02,11.95 | v7.07,8.2 7.37,7.89 7.37,7.61 7.72,7.26 U2.16 | JP1.1 4.08,2.09 v4.29,1.88 | R8.1 2.52,30.48 2.52,28.66 2.52,28.04
  Top 0.356: U2.6 3.42,6.62 6,9.2 v6.03,9.18 | R13.1 2.59,21.33 J2.1
  Top 0.508: C4.1 16.85,32.01 C1.2 | U1.1 21.96,34.02 v22.82,33.16
  Top 0.66: 2.52,28.66 v2.85,28.33 | C11.2 2.31,26.26 CHRG1.2 2.31,28.04 2.52,28.04 2.63,28.04 2.98,28.38 4.75,28.38 C8.1 4.88,27.33 R10.1 | v11.13,28.09 LDO1.2 9.63,27.9 9.02,27.9 8.48,27.36 C9.1 | v11.13,28.09 v11.14,28.1 | C10.2 10.49,30.68 10.49,29.8 10.5,29.8 10.62,29.8 10.9,29.51 10.9,28.32 v11.13,28.09
  pour Bottom (isolate 0.178): 0.78,35.85 35,35.85 37.03,33.82 37.03,2.09 35.52,0.58 2.21,0.58 0.78,2.01
LED1
  Top 0.152: R7.2 32.13,25.39 32.13,27.54 31.45,28.22 U1.31
LED2
  Top 0.152: U1.33 32.15,29.62 32.67,29.1 32.67,26.47 33.1,26.04 33.97,26.04 R11.2
MOSI  (via drill 0.35)
  Top 0.152: U3.19 20.52,17.23 20.56,17.2 v20.56,16.67 | v28.59,25.39 30.51,25.39 U1.27
  Bottom 0.152: v20.56,16.67 20.64,16.59 24.2,16.59 28.57,20.95 28.57,24.84 28.59,24.86 v28.59,25.39
N$1
  Top 0.152: R17.2 14.92,21.44 U3.11
N$2
  Top 0.152: R18.1 30,19.93 30,20.29 25.67,20.29 25.42,20.04 U3.26
N$3
  Top 0.152: U3.2 8.62,20.14 7.87,20.89 C16.2
N$4
  Top 0.152: U1.13 22.44,21.17 21.61,21.17 20.89,21.89 XTAL1.P$1 19.16,21.35 16.61,21.35 16.53,21.43 C5.2
N$5
  Top 0.152: C16.1 9.32,22.35 U3.3
N$6
  Top 0.152: U1.14 23.14,23.84 20.05,23.84 XTAL1.P$2 19.7,23.22 18.79,22.32 C7.1
N$7
  Top 0.152: U3.4 10.02,21.56 C14.2
N$8
  Top 0.152: U3.5 10.72,20.07 11.42,20.77 11.42,23.42 C14.1
N$9
  Top 0.152: R7.1 32.32,23.4 LED2.A
N$10
  Top 0.152: R11.1 33.97,22.54 33.88,22.46 LED4.A
N$11
  Top 0.457: U1.10 18.98,25.42 16.44,27.97 16.44,29.83 L1.1
N$12
  Top 0.457: U1.9 19.35,26.12 18.26,27.21 L1.2 | L1.2 | C1.1 18.26,31.41 L1.2
N$13
  Top 0.152: C13.2 30.06,18.4 29.95,18.4 28.51,19.84 27.07,19.84 26.99,19.92 26.82,19.76 U3.28
N$15
  Top 0.152: C15.2 26.12,15.33 U3.27
N$17
  Top 0.152: CHRG1.5 1.36,31.03 R8.2
N$29
  Top 0.152: U2.12 8.26,4.81 11.39,4.81 12.42,5.83 R3.2
N$30
  Top 0.152: R4.2 10.47,4.08 U2.11
N$31
  Top 0.152: R6.2 14.97,8.95 LED1.C
N$32
  Top 0.152: R9.2 13.51,10.87 LED3.C
RESET  (via drill 0.35)
  Top 0.152: D3.+ 35.31,9.56 C12.2 | U1.35 31.97,31.02 v31.98,31.01 | DEBUG1.10 35.92,27.38 35.92,12.27 35.31,11.67 D3.+ | SW2.1 35.22,13.42 R16.1 35.31,13.12 D3.+
  Bottom 0.152: v31.98,31.01 32.71,30.28 32.71,27.27 33.23,26.75 35.35,26.75 35.67,27.06 DEBUG1.10
RXD.FT  (via drill 0.35)
  Top 0.152: v8.71,13.93 8.71,13.79 6.65,11.73 6.65,11.28 3.48,8.11 3.03,8.11 U2.4 | v16,14.63 17.9,12.73 R14.1
  Bottom 0.152: v8.71,13.93 15.29,13.93 v16,14.63
RXD.NRF  (via drill 0.35)
  Top 0.152: U1.21 28.04,24.53 v27.69,24.89 | v24.59,9.98 22.57,9.98 R15.2
  Bottom 0.152: v27.69,24.89 27.69,20.77 24.68,17.76 19.52,17.76 18.92,17.16 18.92,15.29 19.67,14.55 22.67,14.55 24.59,12.63 v24.59,9.98
RXLED
  Top 0.152: U2.17 8.68,7.89 9.74,8.95 R6.1
SCK  (via drill 0.35)
  Top 0.152: U3.18 19.82,16.45 19.8,16.43 v19.8,16.05 | v29.18,24.59 30.41,24.59 U1.26
  Bottom 0.152: v19.8,16.05 24.09,16.05 29.18,21.13 v29.18,24.59
SCL  (via drill 0.35)
  Top 0.152: U1.3 20.54,30.32 20.03,30.83 19.51,30.83 19.51,30.88 v19.45,30.94 | J1.2 6.27,33.86 4.78,35.34 2.75,35.34 R2.1
  Bottom 0.152: v19.45,30.94 19.33,30.82 14.79,30.82 13.65,31.96 13.65,33.8 7.07,33.8 J1.2
SDA  (via drill 0.35)
  Top 0.152: U1.2 20.37,31.99 20.2,31.99 v20.18,32.01 | R1.1 5,34.6 J1.1
  Bottom 0.152: v20.18,32.01 17.69,34.5 6.5,34.5 J1.1
SWCLK
  Top 0.152: DEBUG1.4 35.67,31.59 36.46,32.37 36.46,33.37 35.88,33.94 34.47,33.94 32.24,31.72 U1.36
SWDIO  (via drill 0.35)
  Top 0.152: U1.37 31.84,32.42 v31.91,32.48
  Bottom 0.152: v31.91,32.48 32.56,33.14 32.56,33.75 34.47,35.66 35.33,35.66 35.8,35.19 35.8,32.84 DEBUG1.2
SWO  (via drill 0.35)
  Top 0.152: U1.32 31.78,28.92 v31.87,28.82
  Bottom 0.152: v31.87,28.82 32.1,28.59 32.1,26.98 32.8,26.28 35.63,26.28 36.42,27.07 36.42,29.42 DEBUG1.6
TXD.FT  (via drill 0.35)
  Top 0.152: U2.20 7.91,10.06 7.91,12.16 8.34,12.59 v8.37,12.56 | R15.1 20.65,9.92 18.83,9.92 18.67,10.08 18.67,11.01 16.69,12.98 16.39,12.69 v16.07,12.69
  Bottom 0.152: v16.07,12.69 8.49,12.69 v8.37,12.56
TXD.NRF  (via drill 0.35)
  Top 0.152: U1.19 26.64,23.91 v26.78,24.05 | v22.27,13.82 22.38,13.82 22.38,12.95 R14.2
  Bottom 0.152: v26.78,24.05 25.6,22.86 25.6,19.11 24.55,18.06 19.39,18.06 18.62,17.29 18.62,16.73 18.46,16.57 18.46,15.32 19.54,14.24 20.3,14.24 20.31,14.23 22.11,14.23 22.27,14.08 v22.27,13.82
TXLED  (via drill 0.35)  (1 unrouted)
  Top 0.152: R9.1 10.65,10.24 8.86,10.24 8.4,10.7 8.4,11.18 v8.54,11.32 | U2.10 3.26,4.08 3.72,4.54 3.72,6.08 6.21,8.57 6.42,8.57 6.95,9.11 6.95,10.22 7.3,10.56 v7.3,11.4
  Bottom 0.152: 7.25,11.18 7.3,11.18 7.42,11.29 7.42,11.32 v8.54,11.32
USB+  (via drill 0.35)
  Top 0.152: C3.1 14.83,3.04 12.91,4.61 R4.1 12.52,3.73 12.52,1.94 8.04,1.94 6.89,3.09 6.89,5.91 6.43,6.37 6.43,7.55 v6.39,7.59
  Bottom 0.152: USB1.3 6.27,6.57 6.3,6.59 6.3,7.53 6.36,7.59 v6.39,7.59
USB-  (via drill 0.35)
  Top 0.152: R3.1 16.01,6.34 C2.2 16.77,5.45 16.77,1.87 16.54,1.64 7.92,1.64 6.32,3.23 6.32,5.6 v6.28,5.64
  Bottom 0.152: v6.28,5.64 6.01,5.92 USB1.2
V_USB  (via drill 0.35)  (1 unrouted)
  Top 0.152: U2.15 8.16,6.61 7.05,6.61 v7.05,6.7
  Bottom 0.406: USB1.1 5.23,4.89 6.22,4.89 D2.+
VIN  (via drill 0.35)  (1 unrouted)
  Top 0.152: LDO1.3 8.12,25.44 6.9,25.44
  Top 0.66: CHRG1.4 4.55,29.63 C8.2 | R5.2 6.39,30.66 6.39,29.95 C8.2 | C8.2 5.33,29.95 6.9,28.39 6.9,25.44 6.9,23.29 6.23,23.29 6.23,18.19 7.79,16.63 9.71,16.63 10.55,15.79 10.55,13.18 9.88,12.51 v9.88,11.44 | LDO1.1 8.14,29.04 C9.2 7.04,29.05 6.39,29.7
  Bottom 0.61: 9.33,5.81 9.33,2.97 8.5,2.14 D1.-
  Bottom 0.66: v9.88,11.44 9.88,6.36 9.33,5.81
  Bottom 0.711: D2.- 7.73,1.84 D1.-
VLIPO  (via drill 0.35)
  Top 0.356: R12.2 3.8,18.59 3.86,18.53 3.86,16.73 J2.2
  Top 0.66: CHRG1.3 3.24,27 3.24,25.59 C11.1 3.69,25.94 3.5,25.94 4.24,26.68 4.24,26.57 v4.18,26.5
  Bottom 0.61: J2.2 5.3,15.46 | D1.+ 8.03,7.55 8.4,7.93
  Bottom 0.66: v4.18,26.5 4.18,25.88 4.43,25.62 4.43,25.36 4.54,25.25 4.54,24.45 4.29,24.19 4.29,17.16 J2.2 | 8.4,7.93 8.4,8.25 6.75,9.91 6.75,10.73 5.29,12.19 5.29,13.21 5.3,13.23 5.3,15.46

### Text on the board
tNames: +
bNames: +